# Altium schematic sheet Avalon_PDU.SchDoc
size A4
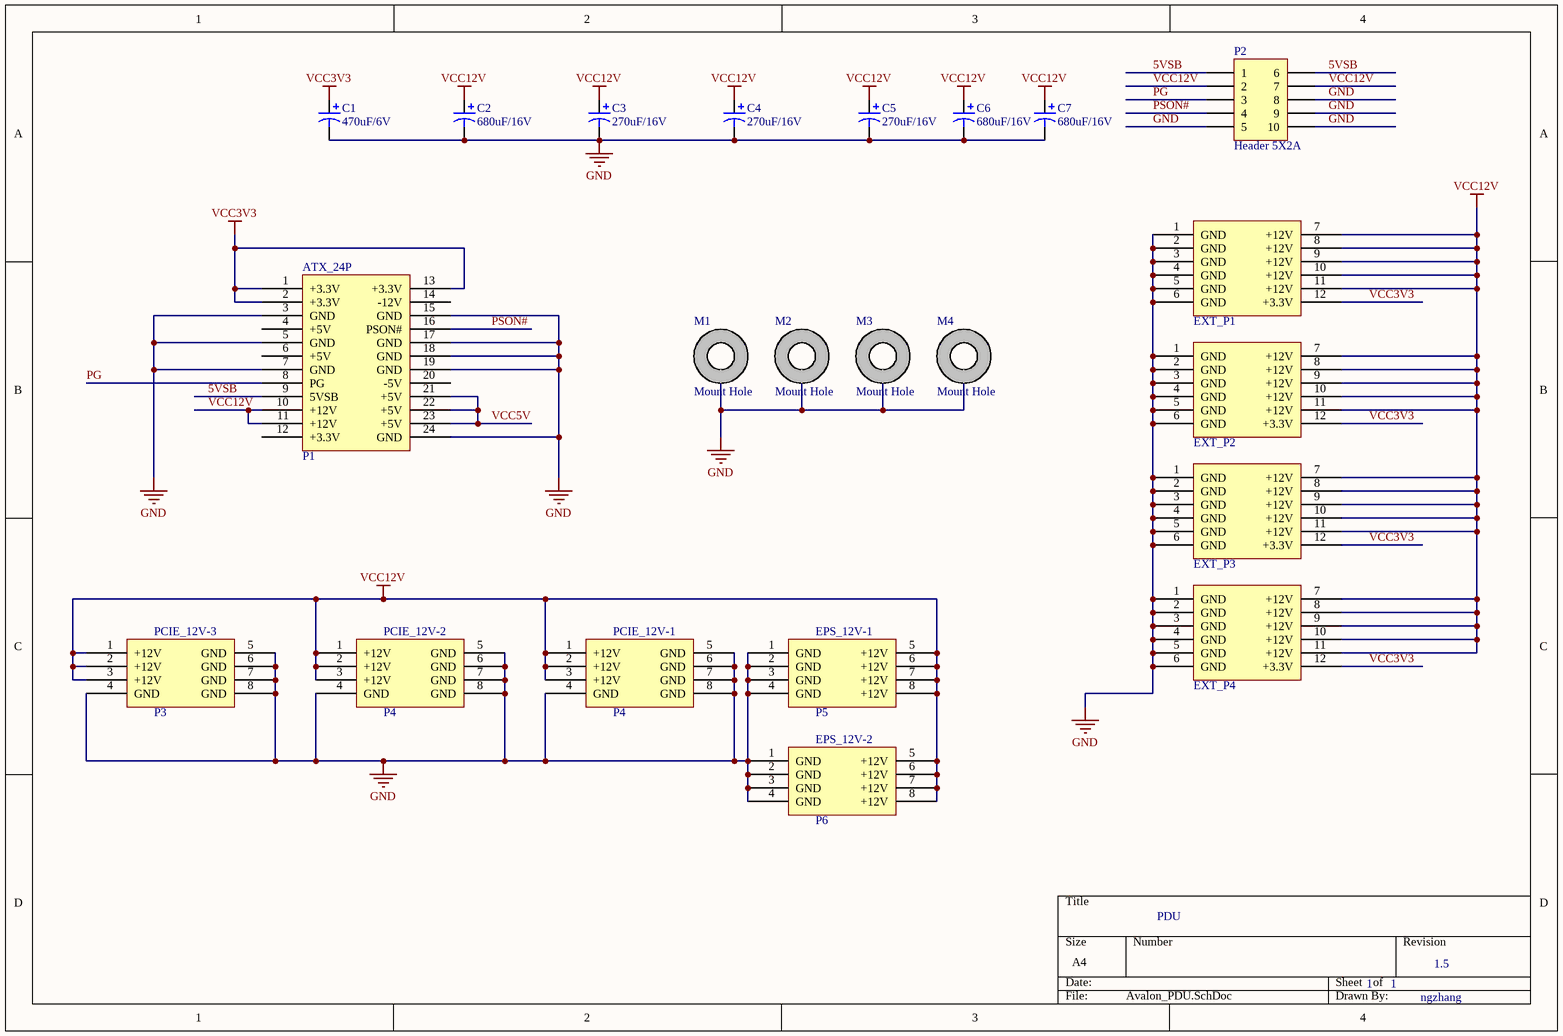
[diagram p0: Avalon_PDU.SchDoc]

## Parts
ATX_24P  P1  [ATX_24P]
C1  470uF/6V  [CAP8X8]
C2  680uF/16V  [CAP8X8]
C3  270uF/16V  [CAP8X8]
C4  270uF/16V  [CAP8X8]
C5  270uF/16V  [CAP8X8]
C6  680uF/16V  [CAP8X8]
C7  680uF/16V  [CAP8X8]
EPS_12V-1  P5  [EPS_12V]
EPS_12V-2  P6  [EPS_12V]
EXT_P1  PWR_12P  [PWR_12PIN]  (value not drawn)
EXT_P2  PWR_12P  [PWR_12PIN]  (value not drawn)
EXT_P3  PWR_12P  [PWR_12PIN]  (value not drawn)
EXT_P4  PWR_12P  [PWR_12PIN]  (value not drawn)
M1  Mount Hole  [MHOLE2]
M2  Mount Hole  [MHOLE2]
M3  Mount Hole  [MHOLE2]
M4  Mount Hole  [MHOLE2]
P2  Header 5X2A  [PWR_10PIN]
PCIE_12V-1  P4  [PCIE_12V_V]
PCIE_12V-2  P4  [PCIE_12V_V]
PCIE_12V-3  P3  [PCIE_12V_V]

## Nets
GND: ATX_24P.3(GND) ATX_24P.5(GND) ATX_24P.7(GND) ATX_24P.15(GND) ATX_24P.17(GND) ATX_24P.18(GND) ATX_24P.19(GND) ATX_24P.24(GND) C1.2 C2.2 C3.2 C4.2 C5.2 C6.2 C7.2 EPS_12V-1.1(GND) EPS_12V-1.2(GND) EPS_12V-1.3(GND) EPS_12V-1.4(GND) EPS_12V-2.1(GND) EPS_12V-2.2(GND) EPS_12V-2.3(GND) EPS_12V-2.4(GND) EXT_P1.1(GND) EXT_P1.2(GND) EXT_P1.3(GND) EXT_P1.4(GND) EXT_P1.5(GND) EXT_P1.6(GND) EXT_P2.1(GND) EXT_P2.2(GND) EXT_P2.3(GND) EXT_P2.4(GND) EXT_P2.5(GND) EXT_P2.6(GND) EXT_P3.1(GND) EXT_P3.2(GND) EXT_P3.3(GND) EXT_P3.4(GND) EXT_P3.5(GND) EXT_P3.6(GND) EXT_P4.1(GND) EXT_P4.2(GND) EXT_P4.3(GND) EXT_P4.4(GND) EXT_P4.5(GND) EXT_P4.6(GND) M1.0(PIN) M2.0(PIN) M3.0(PIN) M4.0(PIN) P2.5 P2.8 P2.9 P2.10 PCIE_12V-1.4(GND) PCIE_12V-1.5(GND) PCIE_12V-1.6(GND) PCIE_12V-1.7(GND) PCIE_12V-1.8(GND) PCIE_12V-2.4(GND) PCIE_12V-2.5(GND) PCIE_12V-2.6(GND) PCIE_12V-2.7(GND) PCIE_12V-2.8(GND) PCIE_12V-3.4(GND) PCIE_12V-3.5(GND) PCIE_12V-3.6(GND) PCIE_12V-3.7(GND) PCIE_12V-3.8(GND)
VCC3V3: ATX_24P.1(+3.3V) ATX_24P.2(+3.3V) ATX_24P.13(+3.3V) C1.1 EXT_P1.12(+3.3V) EXT_P2.12(+3.3V) EXT_P3.12(+3.3V) EXT_P4.12(+3.3V)
VCC12V: ATX_24P.10(+12V) ATX_24P.11(+12V) C2.1 C3.1 C4.1 C5.1 C6.1 C7.1 EPS_12V-1.5(+12V) EPS_12V-1.6(+12V) EPS_12V-1.7(+12V) EPS_12V-1.8(+12V) EPS_12V-2.5(+12V) EPS_12V-2.6(+12V) EPS_12V-2.7(+12V) EPS_12V-2.8(+12V) EXT_P1.7(+12V) EXT_P1.8(+12V) EXT_P1.9(+12V) EXT_P1.10(+12V) EXT_P1.11(+12V) EXT_P2.7(+12V) EXT_P2.8(+12V) EXT_P2.9(+12V) EXT_P2.10(+12V) EXT_P2.11(+12V) EXT_P3.7(+12V) EXT_P3.8(+12V) EXT_P3.9(+12V) EXT_P3.10(+12V) EXT_P3.11(+12V) EXT_P4.7(+12V) EXT_P4.8(+12V) EXT_P4.9(+12V) EXT_P4.10(+12V) EXT_P4.11(+12V) P2.2 P2.7 PCIE_12V-1.1(+12V) PCIE_12V-1.2(+12V) PCIE_12V-1.3(+12V) PCIE_12V-2.1(+12V) PCIE_12V-2.2(+12V) PCIE_12V-2.3(+12V) PCIE_12V-3.1(+12V) PCIE_12V-3.2(+12V) PCIE_12V-3.3(+12V)
5VSB: ATX_24P.9(5VSB) P2.1 P2.6
PG: ATX_24P.8(PG) P2.3
PSON#: ATX_24P.16(PSON#) P2.4
VCC5V: ATX_24P.21(+5V) ATX_24P.22(+5V) ATX_24P.23(+5V)

Not connected (* = marked no-connect by the designer): ATX_24P 4(+5V) 6(+5V) 12(+3.3V) 14(-12V) 20(-5V)

## Notes on the sheet
- PDU
- 1      1
- 1.5
- ngzhang

## Library data of the parts
ATX_24P = ATX_24P
C1-C7 = Cap Pol3: Polarized Capacitor (Surface Mount); Published: 8-Jun-2000; LatestRevisionDate: 29-May-2009; LatestRevisionNote: IPC-7351 Footprint Added.; PackageReference: C0805; Publisher: Altium Limited; PackageDescription: Chip Capacitor
  C1: Value: 470uF/6V
  C2 C6 C7: Value: 680uF/16V
  C3-C5: Value: 270uF/16V
EPS_12V-1 EPS_12V-2 = EPS_12V
M1-M4 = M_Hole
P2 = Header 5X2A: Header, 5-Pin, Dual row; LatestRevisionDate: 17-Jul-2002; LatestRevisionNote: Re-released for DXP Platform.; Publisher: Altium Limited
PCIE_12V-1-PCIE_12V-3 = PCIE_12V